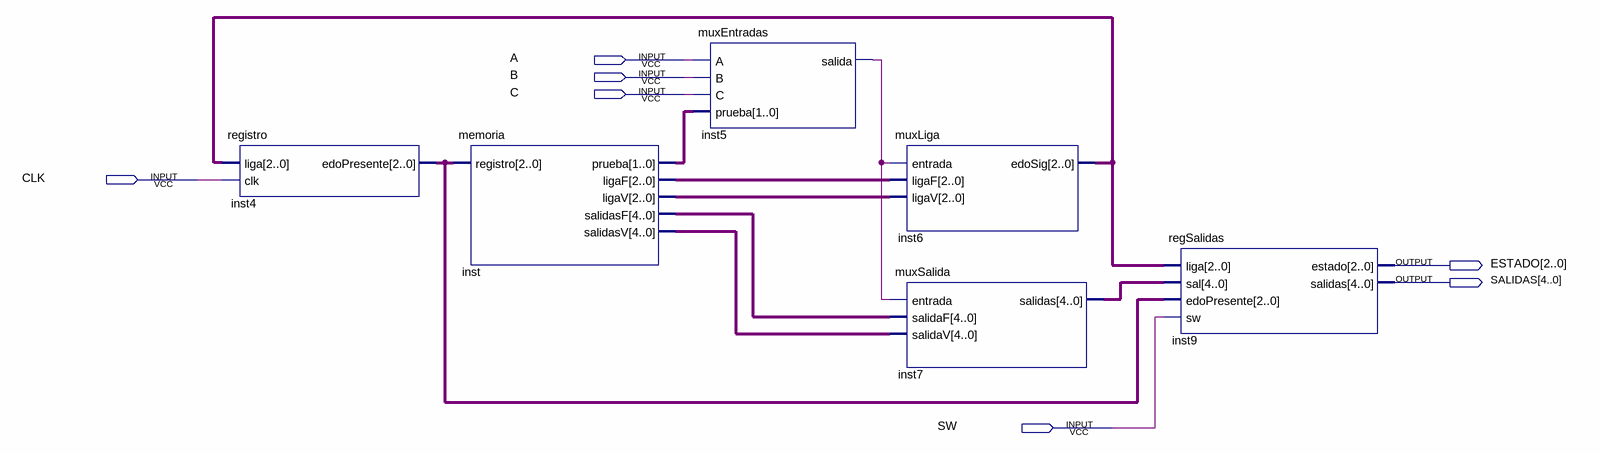
[diagram p0: schematic sheet]
// Quartus schematic practica4.bdf as structural Verilog: 6 symbols, 7 pins
module practica4 (
  input  A,
  input  B,
  input  C,
  input  CLK,
  input  SW,
  output [2:0] ESTADO,
  output [4:0] SALIDAS
);

  wire inst5_salida;
  wire [1:0] inst_prueba;
  wire [2:0] inst4_edopresente, inst6_edosig, inst_ligaf, inst_ligav;
  wire [4:0] inst7_salidas, inst_salidasf, inst_salidasv;

  registro inst4 (.liga(inst6_edosig), .clk(CLK), .edoPresente(inst4_edopresente));
  memoria inst (
    .registro(inst4_edopresente), .prueba(inst_prueba), .ligaF(inst_ligaf), .ligaV(inst_ligav),
    .salidasF(inst_salidasf), .salidasV(inst_salidasv));
  muxEntradas inst5 (.A(A), .B(B), .C(C), .prueba(inst_prueba), .salida(inst5_salida));
  muxLiga inst6 (.entrada(inst5_salida), .ligaF(inst_ligaf), .ligaV(inst_ligav), .edoSig(inst6_edosig));
  muxSalida inst7 (.entrada(inst5_salida), .salidaF(inst_salidasf), .salidaV(inst_salidasv), .salidas(inst7_salidas));
  regSalidas inst9 (
    .liga(inst6_edosig), .sal(inst7_salidas), .edoPresente(inst4_edopresente), .sw(SW), .estado(ESTADO),
    .salidas(SALIDAS));
endmodule
